# EasyEDA schematic SCH_MPU6050_2021-10-01.json
TITLE: Sheet_1; REV: 1.0; Date: 2021-09-28; Sheet: 1/1; Drawn By: Jonar Verbart; Company: ChimeTime
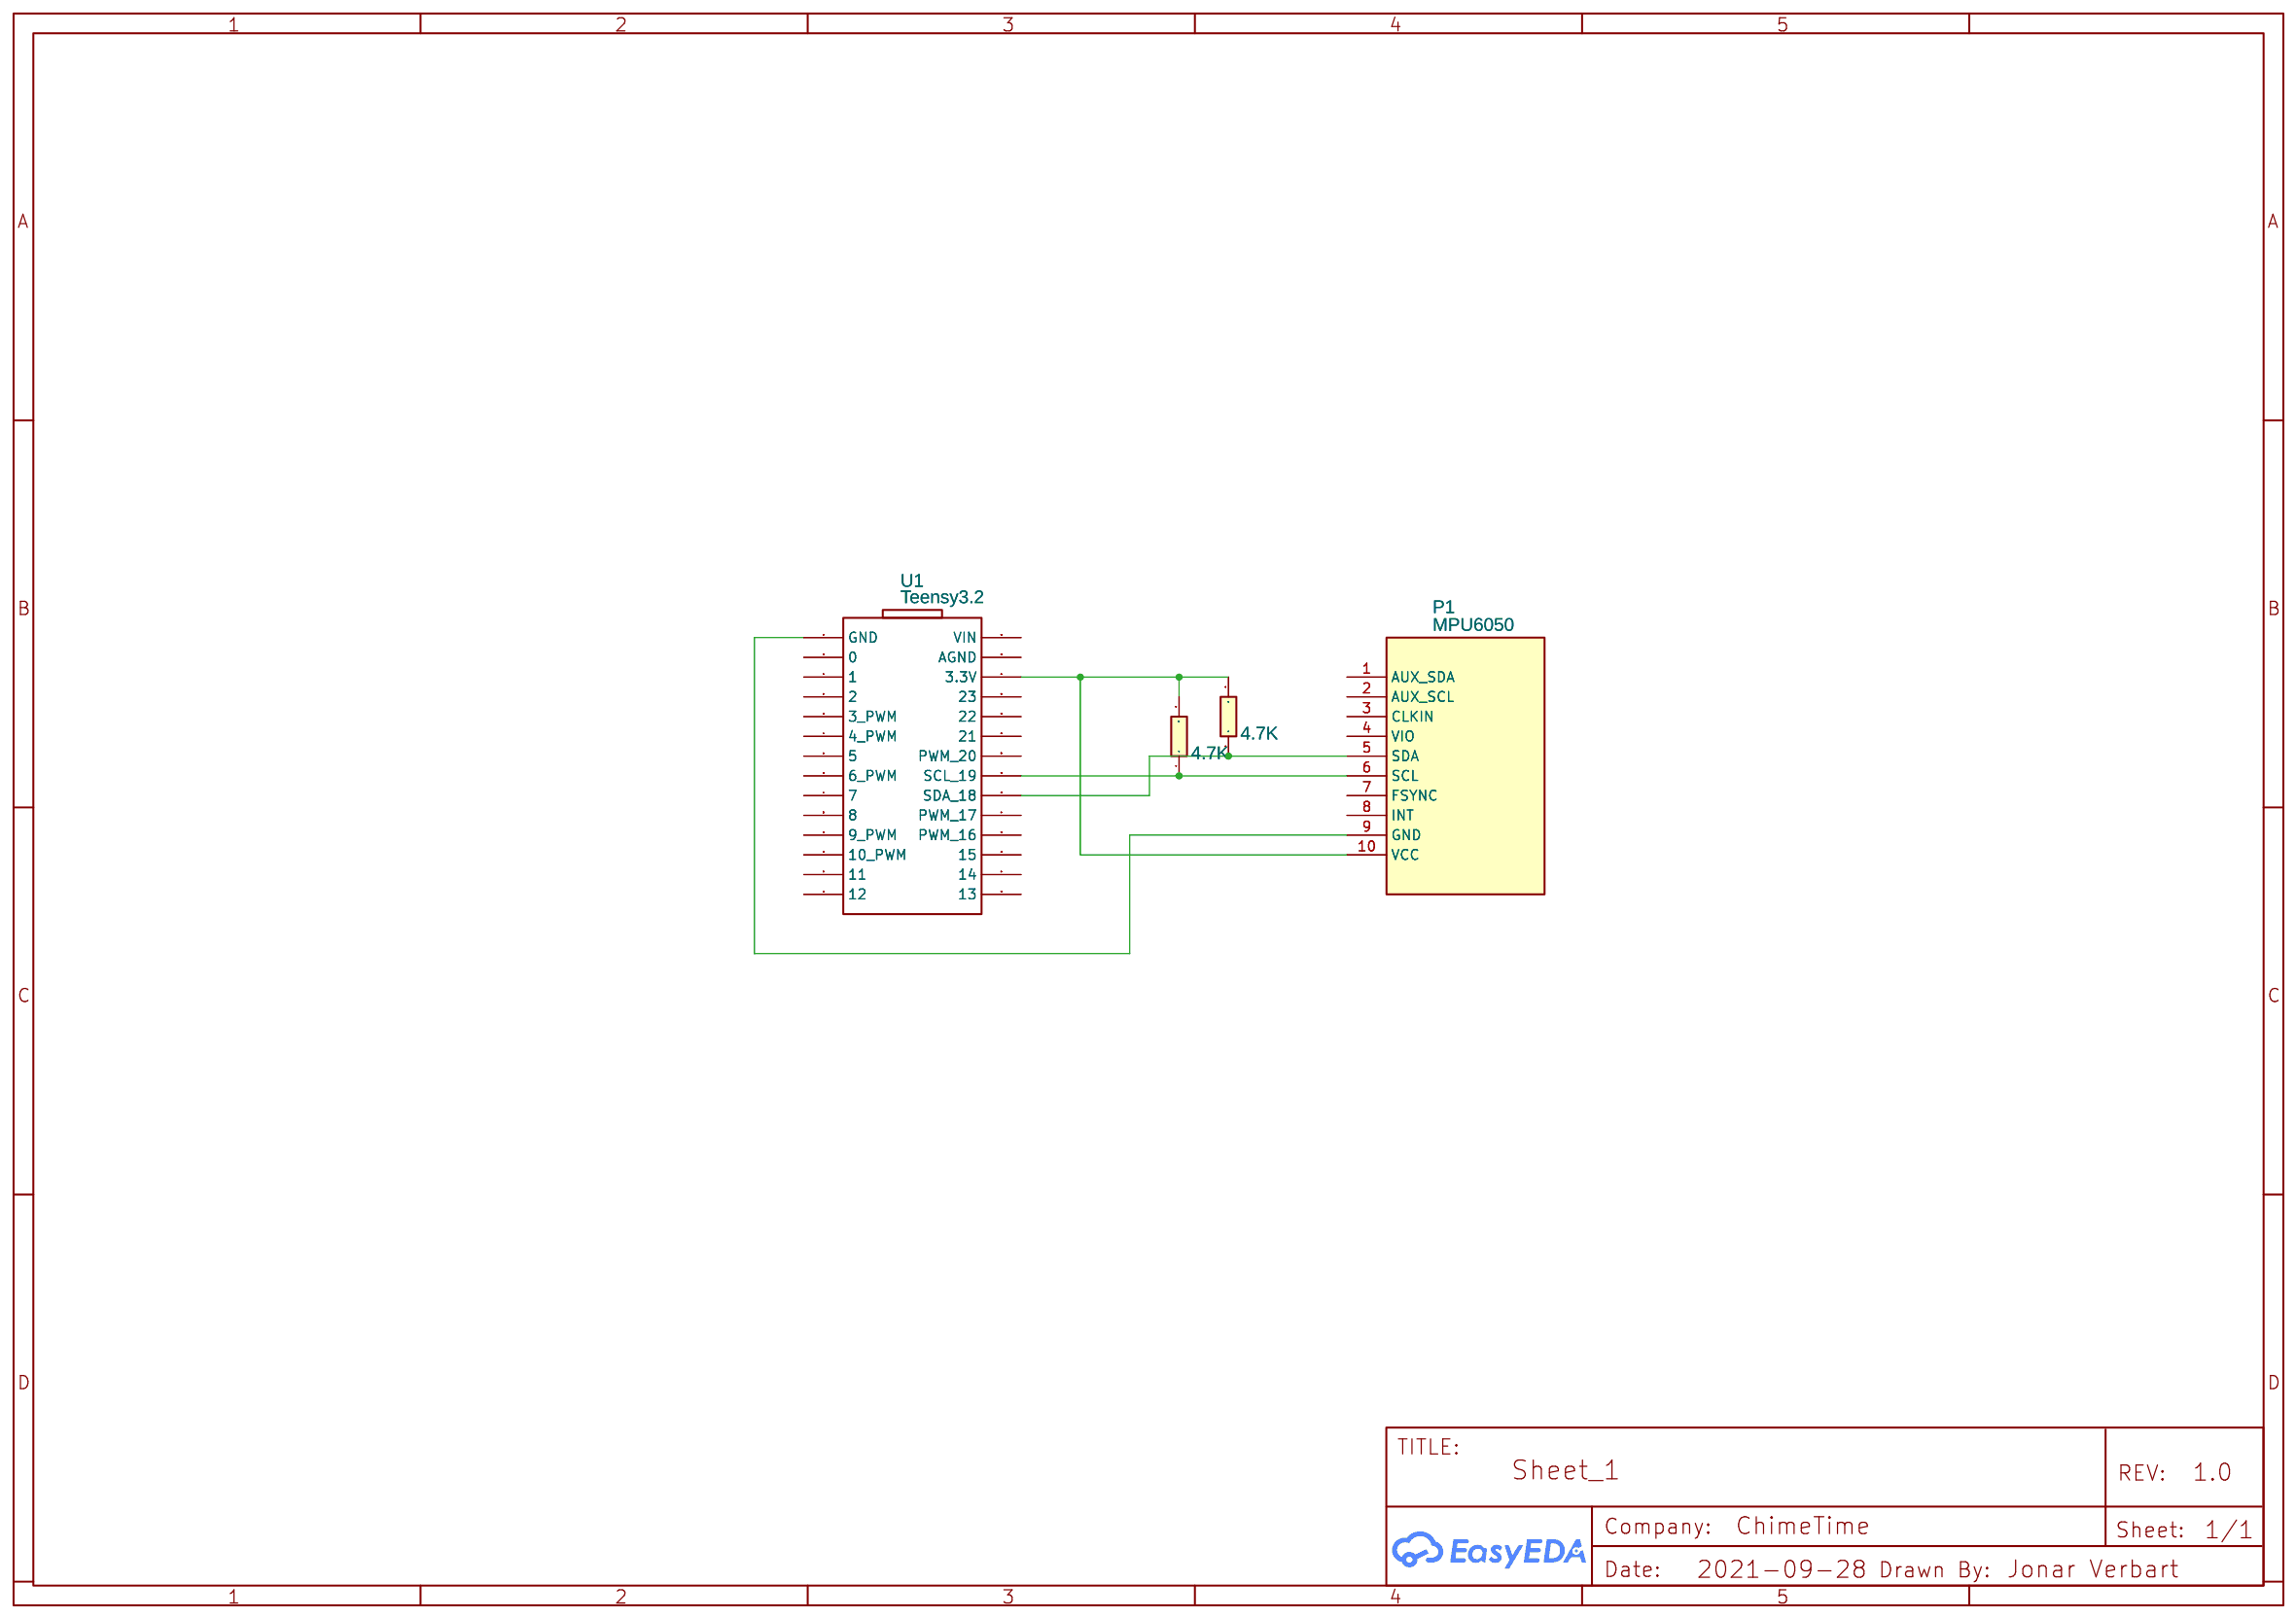
[diagram p0: schematic sheet]

## Parts
4.7K  4.7K  [L0603]
L2  4.7K  [L0603]
P1  MPU6050  [MPU6050]
U1  Teensy3.2  [TEENSY3.2]

## Library data of the parts
4.7K L2 = L0603_EU: Contributor: LCEDA_Lib
P1 = MPU6050: sourceId: 1T5FDZYC8; Contributor: Sofiane_dev
U1 = Teensy3.2: Manufacturer Part: Teensy 3.2; Contributor: Dirk Alferink

## Nets
Net-(4.7K-1): 4.7K.1 P1.5(SDA) U1.18(SDA 18)
Net-(4.7K-2): 4.7K.2 L2.2 P1.10(VCC) U1.24(3.3V)
Net-(L2-1): L2.1 P1.6(SCL) U1.19(SCL 19)
Net-(P1-9): P1.9(GND) U1.27(GND)

Not connected (* = marked no-connect by the designer): P1 1(AUX_SDA) 2(AUX_SCL) 3(CLKIN) 4(VIO) 7(FSYNC) 8(INT); U1 0 1 2 3(3 PWM) 4(4 PWM) 5 6(6 PWM) 7 8 9(9 PWM) 10(10 PWM) 11 12 13 14 15 16(PWM 16) 17(PWM 17) 20(PWM 20) 21 22 23 25(AGND) 26(VIN)
